# Altium schematic sheet MotorDriver.SchDoc: Group 32 Car Motor Drivers
size A4
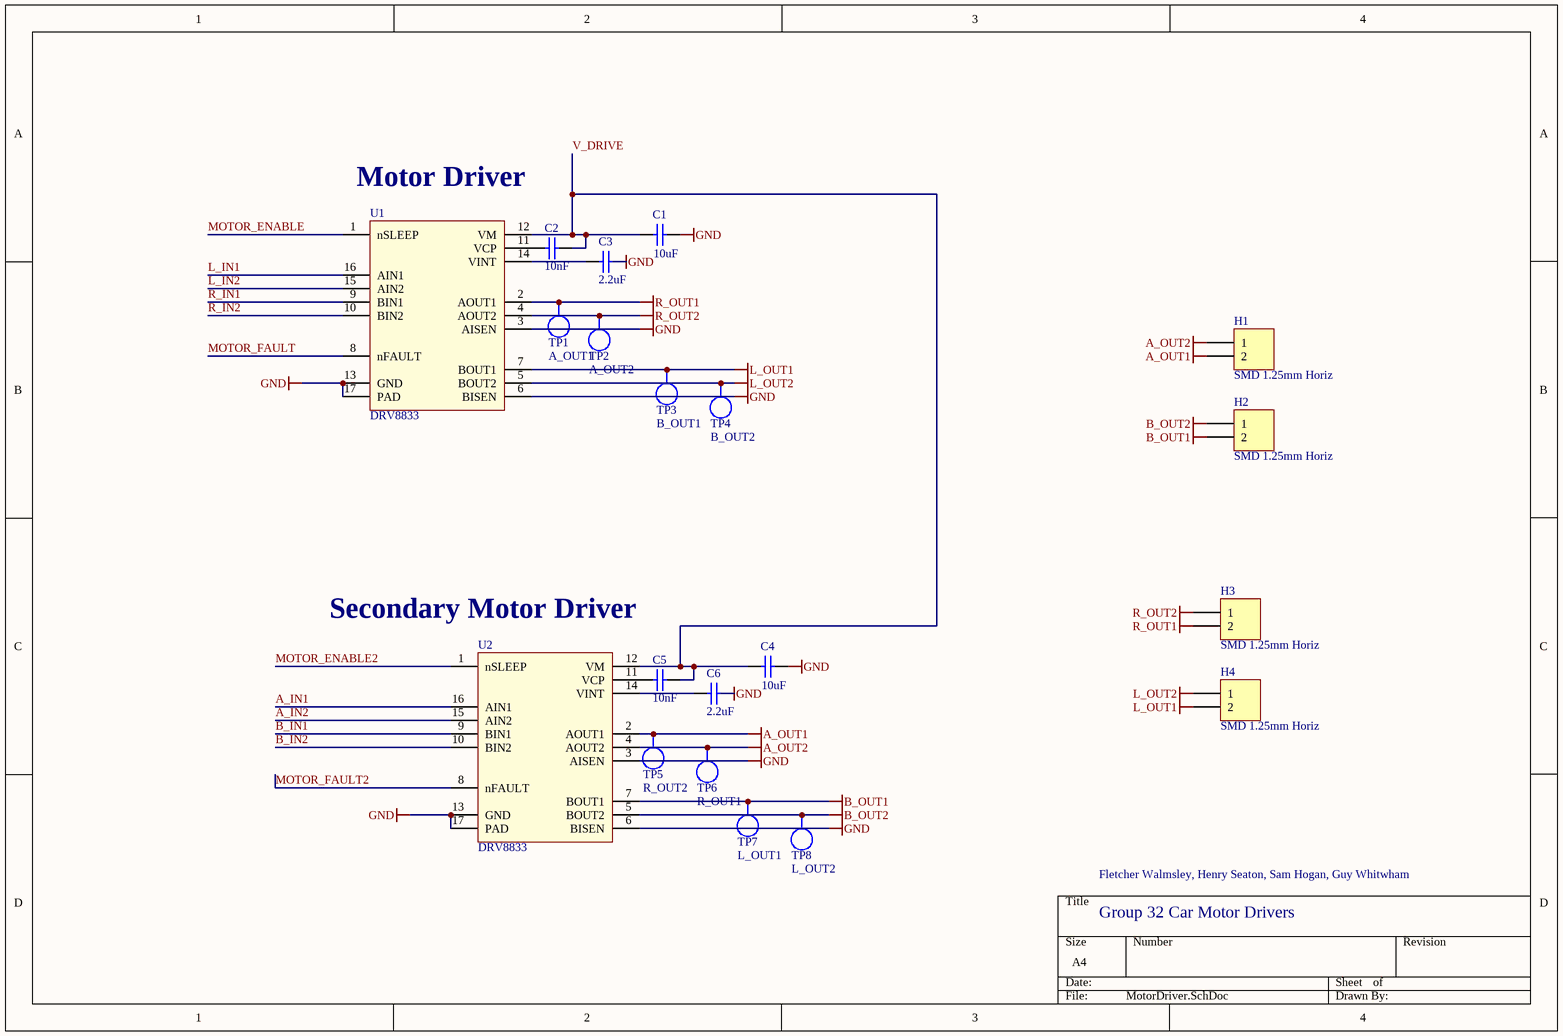
[diagram p0: MotorDriver.SchDoc]

## Parts
C1  10uF  [CAPC2012L]
C2  10nF  [CAPC1608L]
C3  2.2uF  [CAPC1608L]
C4  10uF  [CAPC2012L]
C5  10nF  [CAPC1608L]
C6  2.2uF  [CAPC1608L]
H1  SMD 1.25mm Horiz  [SD-53261-0219]
H2  SMD 1.25mm Horiz  [SD-53261-0219]
H3  SMD 1.25mm Horiz  [SD-53261-0219]
H4  SMD 1.25mm Horiz  [SD-53261-0219]
TP1  A_OUT1  [TP_1206]  (no BOM)
TP2  A_OUT2  [TP_1206]  (no BOM)
TP3  B_OUT1  [TP_1206]  (no BOM)
TP4  B_OUT2  [TP_1206]  (no BOM)
TP5  R_OUT2  [TP_1206]  (no BOM)
TP6  R_OUT1  [TP_1206]  (no BOM)
TP7  L_OUT1  [TP_1206]  (no BOM)
TP8  L_OUT2  [TP_1206]  (no BOM)
U1  DRV8833  [HTSOP16]
U2  DRV8833  [HTSOP16]

## Nets
A_OUT1: H1.2 TP5.1 U2.2(AOUT1)
A_OUT2: H1.1 TP6.1 U2.4(AOUT2)
B_OUT1: H2.2 TP7.1 U2.7(BOUT1)
B_OUT2: H2.1 TP8.1 U2.5(BOUT2)
GND: C1.1 C3.1 C4.1 C6.1 U1.3(AISEN) U1.6(BISEN) U1.13(GND) U1.17(PAD) U2.3(AISEN) U2.6(BISEN) U2.13(GND) U2.17(PAD)
L_OUT1: H4.2 TP3.1 U1.7(BOUT1)
L_OUT2: H4.1 TP4.1 U1.5(BOUT2)
R_OUT1: H3.2 TP1.1 U1.2(AOUT1)
R_OUT2: H3.1 TP2.1 U1.4(AOUT2)
A_IN1: U2.16(AIN1)
A_IN2: U2.15(AIN2)
B_IN1: U2.9(BIN1)
B_IN2: U2.10(BIN2)
L_IN1: U1.16(AIN1)
L_IN2: U1.15(AIN2)
MOTOR_ENABLE: U1.1(nSLEEP)
MOTOR_ENABLE2: U2.1(nSLEEP)
MOTOR_FAULT: U1.8(nFAULT)
MOTOR_FAULT2: U2.8(nFAULT)
R_IN1: U1.9(BIN1)
R_IN2: U1.10(BIN2)
V_DRIVE: C1.2 C2.2 C4.2 C5.2 U1.12(VM) U2.12(VM)
NetC2_1: C2.1 U1.11(VCP)
NetC3_2: C3.2 U1.14(VINT)
NetC5_1: C5.1 U2.11(VCP)
NetC6_2: C6.2 U2.14(VINT)

## Notes on the sheet
- Motor Driver
- Secondary Motor Driver
- Fletcher Walmsley, Henry Seaton, Sam Hogan, Guy Whitwham
- Group 32 Car Motor Drivers

## Library data of the parts
C1 C4 = CC_10uF_16V_0805: CAP CER 10uF X5R 16V 0805; Manufacturer: Samsung Electro-Mechanics; Manufacturer Part Number: CL21A106KOQNNWE; Note: Footprint corresponds to dimensions for bulk cassette packaging. This case size has tightened tolerances.; Tolerance: ±10%; Notification: Current market demand for these product types have resulted in fluctuating and extending lead times. Lead times may differ.; PackageReference: 0805; Code_IPC: 2012[0805]; Supplier 1: Digi-Key; RoHS: RoHS Compliant; Category: Capacitors; Stock 1: 20000; Pricing 1: 1=0.35, 10=0.25, 100=0.1178, 500=0.08254, 1000=0.06831 (NZD); Packaging: Cut Tape (CT); Part Status: Active; Temperature Coefficient: X5R; Operating Temperature: -55°C ~ 85°C; Features: -; Ratings: -; Applications: General Purpose; Mounting Type: Surface Mount, MLCC; Package / Case: 0805 (2012 Metric); Size / Dimension: 0.079" L x 0.049" W (2.00mm x 1.25mm); Height - Seated (Max): -; Thickness (Max): 0.055" (1.40mm); Lead Spacing: -; Lead Style: -; ComponentLink1URL: http://www.samsungsem.com/kr/support/product-search/mlcc/CL21A106KOQNNWE.jsp; ComponentLink1Description: http://www.samsungsem.com/kr/support/product-search/mlcc/CL21A106KOQNNWE.jsp; Supplier Part Number 1: 1276-2894-1-ND; Value: 10uF
C2 C5 = CC_10nF_0603: CAP CER 10nF X7R +-10% 50V 0603; PackageReference: 0603; Code_IPC: 1608 [0603]; Verify: *; Supplier: ECE Dept; Storage Location: PCB Assembly WS; Value: 10nF
C3 C6 = CC_2.2uF_0603: CAP CER 2.2uF X5R +-20% 10V 0603; PackageReference: 0603; Code_IPC: 1608 [0603]; Verify: *; Supplier: ECE Dept; Storage Location: PCB Assembly WS; Value: 2.2uF
H1-H4 = JB_53261-02: Header_Horiz_2Pos_1.25mm_125V@1A_SMT; Manufacturer: MOLEX; Manufacturer Part Number: 53261-0271; External Depth: 4.2; External Length / Height: 3.4; Gender: Header; No. of Contacts: 2; Pitch Spacing: 1.25; Voltage Rating V AC: 125; Contact Termination: Surface Mount Right Angle; Lead Spacing: 1.25; Series: PicoBlade; Pricing: 5=0.27, 100=0.255, 250=0.245, 500=0.225, 1000=0.205 (NZD); Supplier 1: Farnell; Supplier Part Number 1: 1125373; Supplier 2: Digi-Key; Supplier Part Number 2: WM7620CT-ND; Supplier: ECE Dept; Storage Location: PCB Assembly WS; Value: SMD 1.25mm Horiz
TP1-TP8 = TP_1206: Test-Point 3.3x1.6x2.1mm SMD; Manufacturer: Harwin Inc; Manufacturer Part Number: S1751-46R; Value: TP; Manufacturer PN: *; Storage Location: ProtoPlace; Mounting Type: Surface Mount; Type: PC Test Point; Supplier 1: Digi-Key; Supplier Part Number 1: 952-1478-2-ND; Supplier 2: Farnell; Supplier Part Number 2: 1826282; Supplier: ECE Dept
U1 U2 = DRV8833: Dual H-Bridge Motor Driver 1.5A